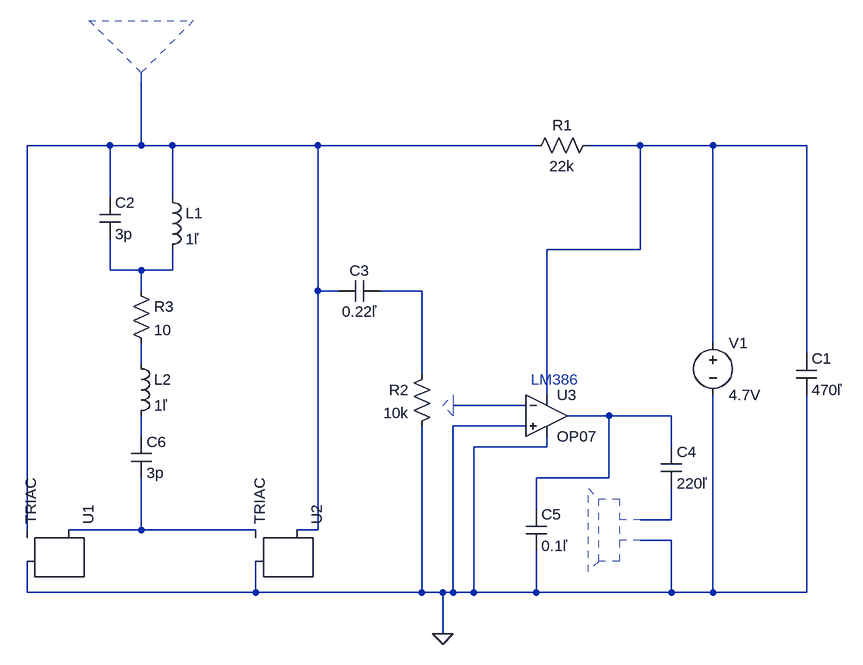
[diagram p0: schematic Radio Reciever (LT Spice).asc]
Radio Reciever (LT Spice).asc, the LTspice schematic file:
Version 4.1
SHEET 1 880 680
WIRE -352 -224 -480 -224
WIRE -304 -224 -304 -336
WIRE -304 -224 -352 -224
WIRE -256 -224 -304 -224
WIRE -32 -224 -256 -224
WIRE 304 -224 -32 -224
WIRE 464 -224 384 -224
WIRE 576 -224 464 -224
WIRE 720 -224 576 -224
WIRE -352 -144 -352 -224
WIRE -256 -144 -256 -224
WIRE 464 -64 464 -224
WIRE 464 -64 320 -64
WIRE -352 -32 -352 -80
WIRE -304 -32 -352 -32
WIRE -256 -32 -256 -64
WIRE -256 -32 -304 -32
WIRE -304 0 -304 -32
WIRE -32 0 -32 -224
WIRE 0 0 -32 0
WIRE 128 0 64 0
WIRE 576 80 576 -224
WIRE 720 96 720 -224
WIRE -304 112 -304 80
WIRE 128 128 128 0
WIRE 320 160 320 -64
WIRE 288 176 176 176
WIRE 416 192 352 192
WIRE 512 192 416 192
WIRE 288 208 176 208
WIRE -304 224 -304 192
WIRE 320 240 320 224
WIRE 320 240 208 240
WIRE 512 240 512 192
WIRE 416 288 416 192
WIRE 416 288 304 288
WIRE 304 336 304 288
WIRE 512 352 512 304
WIRE 512 352 464 352
WIRE -480 368 -480 -224
WIRE -304 368 -304 288
WIRE -304 368 -416 368
WIRE -128 368 -304 368
WIRE -32 368 -32 0
WIRE -32 368 -64 368
WIRE 512 384 464 384
WIRE -480 464 -480 416
WIRE -128 464 -128 416
WIRE -128 464 -480 464
WIRE 128 464 128 208
WIRE 128 464 -128 464
WIRE 160 464 128 464
WIRE 176 464 176 208
WIRE 176 464 160 464
WIRE 208 464 208 240
WIRE 208 464 176 464
WIRE 304 464 304 400
WIRE 304 464 208 464
WIRE 512 464 512 384
WIRE 512 464 304 464
WIRE 576 464 576 160
WIRE 576 464 512 464
WIRE 720 464 720 160
WIRE 720 464 576 464
WIRE 160 528 160 464
FLAG 160 528 0
SYMBOL voltage 576 64 R0
WINDOW 123 0 0 Left 0
WINDOW 39 0 0 Left 0
SYMATTR InstName V1
SYMATTR Value 4.7V
SYMBOL cap 704 96 R0
SYMATTR InstName C1
SYMATTR Value 470ľ
SYMBOL res 400 -240 R90
WINDOW 0 0 56 VBottom 2
WINDOW 3 32 56 VTop 2
SYMATTR InstName R1
SYMATTR Value 22k
SYMBOL cap -368 -144 R0
SYMATTR InstName C2
SYMATTR Value 3p
SYMBOL ind -272 -160 R0
SYMATTR InstName L1
SYMATTR Value 1ľ
SYMBOL cap 64 -16 R90
WINDOW 0 0 32 VBottom 2
WINDOW 3 32 32 VTop 2
SYMATTR InstName C3
SYMATTR Value 0.22ľ
SYMBOL OpAmps\\OP07 320 128 R0
SYMATTR InstName U3
SYMBOL res 144 112 M0
SYMATTR InstName R2
SYMATTR Value 10k
SYMBOL cap 496 240 R0
SYMATTR InstName C4
SYMATTR Value 220ľ
SYMBOL cap 288 336 R0
SYMATTR InstName C5
SYMATTR Value 0.1ľ
SYMBOL res -320 -16 R0
SYMATTR InstName R3
SYMATTR Value 10
SYMBOL ind -320 96 R0
SYMATTR InstName L2
SYMATTR Value 1ľ
SYMBOL cap -320 224 R0
SYMATTR InstName C6
SYMATTR Value 3p
SYMBOL Misc\\TRIAC -416 400 M270
SYMATTR InstName U1
SYMBOL Misc\\TRIAC -64 400 M270
SYMATTR InstName U2
TEXT 296 136 Left 2 ;LM386
LINE Normal 384 304 400 320 2
LINE Normal 384 432 384 304 2
LINE Normal 400 416 384 432 2
LINE Normal 464 352 432 352 2
LINE Normal 464 384 432 384 2
LINE Normal 176 160 176 176 2
LINE Normal 160 176 176 160 2
LINE Normal 176 192 160 176 2
LINE Normal 176 176 176 192 2
LINE Normal -304 -320 -304 -336 2
LINE Normal -224 -416 -304 -336 2
LINE Normal -384 -416 -224 -416 2
LINE Normal -304 -336 -384 -416 2
RECTANGLE Normal 432 416 400 320 2

The netlist it stands for:
* Radio Reciever (LT Spice).asc
V1 N002 0 4.7V
C1 N002 0 470ľ
R1 N002 N001 22k
C2 N001 N003 3p
L1 N001 N003 1ľ
C3 N004 N001 0.22ľ
X§U3 0 N006 N002 0 N007 LT1001  ; OP07, pins In+ In- V+ V- OUT
R2 N004 0 10k
C4 N007 N009 220ľ
C5 N007 0 0.1ľ
R3 N003 N005 10
L2 N005 N008 1ľ
C6 N008 N010 3p
X§U1 N010 0 N001 TRIAC  ; pins MT2 G MT1
X§U2 N001 0 N010 TRIAC  ; pins MT2 G MT1
* LM386
.lib LTC.lib
.backanno
.end